# Altium schematic sheet MPU_6050.SchDoc
size A; SheetNumber: 8; SheetTotal: 11
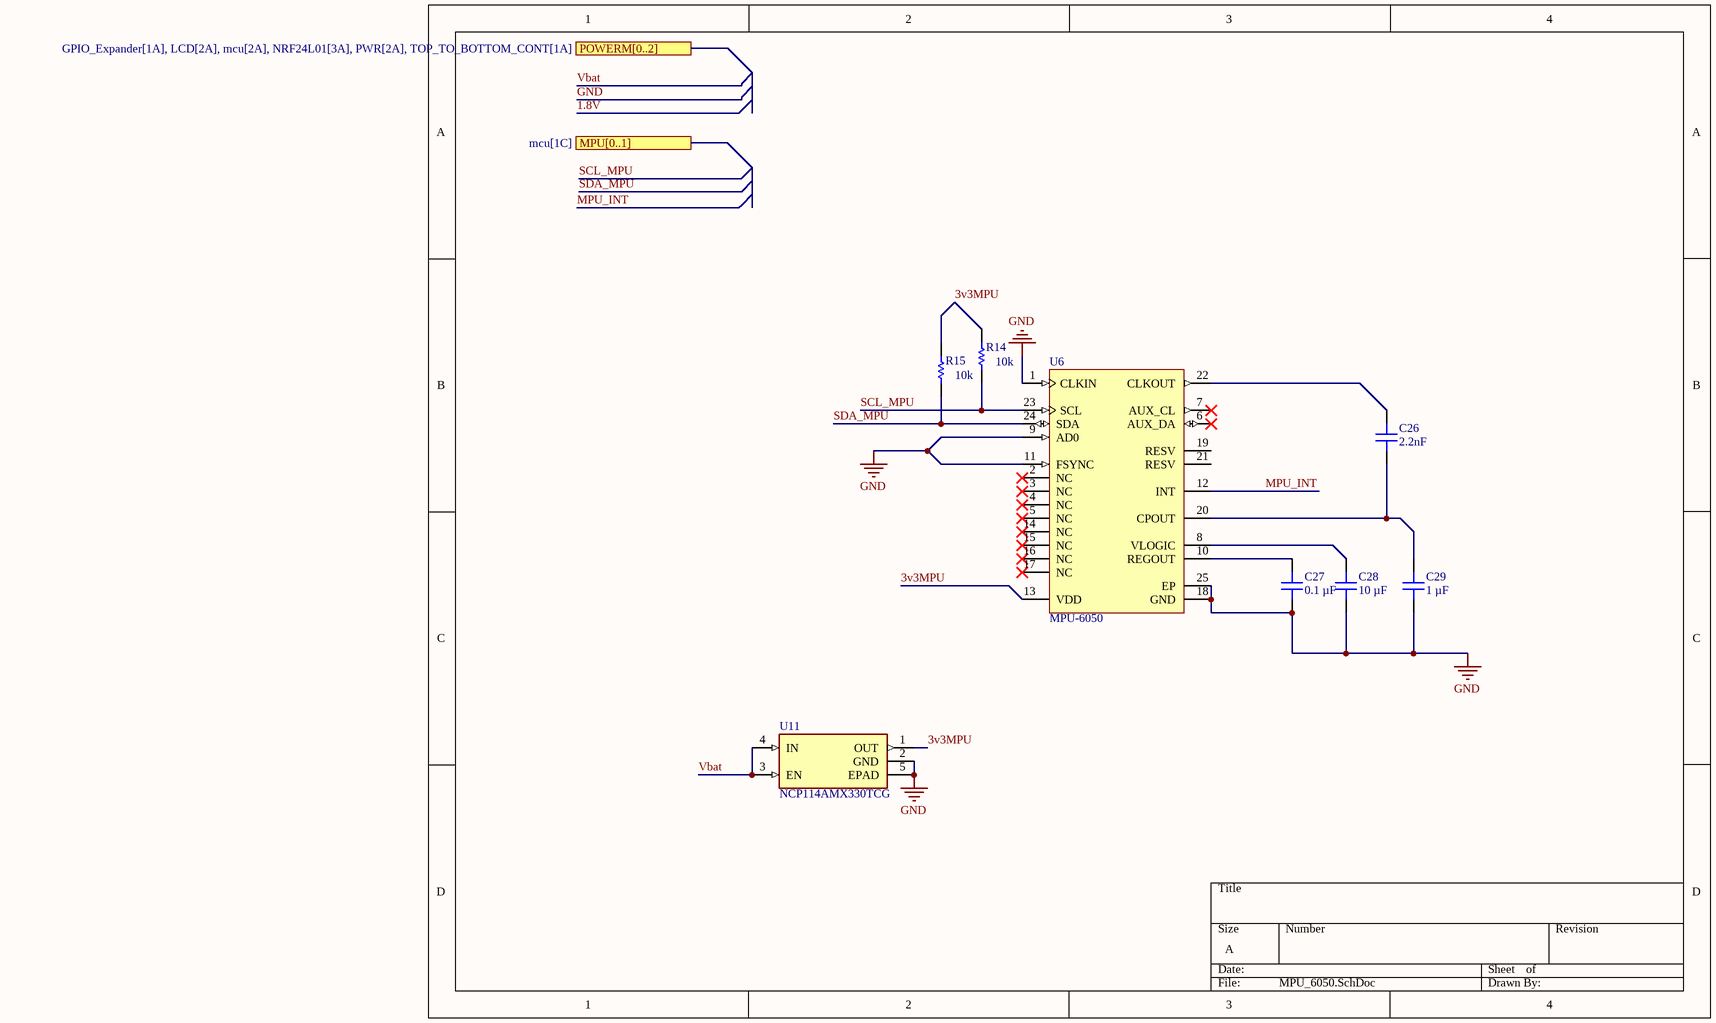
[diagram p0: MPU_6050.SchDoc]

## Parts
C26  Capacitance: 2.2nF  [CAP 0402_1005]
C27  Capacitance: 0.1 µF  [CAP 0402_1005]
C28  Capacitance: 10 µF  [CAP 0402_1005]
C29  Capacitance: 1 µF  [CAP 0402_1005]
R14  resistance: 10k  [RESC1005X40X25LL05T10]  (hidden comment: 0402WGF1002TCE)
R15  resistance: 10k  [RESC1005X40X25LL05T10]  (hidden comment: 0402WGF1002TCE)
U6  MPU-6050  [IS-QFN-24_V]
U11  NCP114AMX330TCG  [REG_NCP114AMX330TCG]

## Ports
MPU[0..1] (see mcu[1C]), POWERM[0..2] (see GPIO_Expander[1A], LCD[2A], mcu[2A], NRF24L01[3A], PWR[2A], TOP_TO_BOTTOM_CONT[1A])

## Nets
GND: C27.1 C28.1 C29.1 U6.1(CLKIN) U6.9(AD0) U6.11(FSYNC) U6.18(GND) U6.25(EP) U11.2(GND) U11.5(EPAD)
3v3MPU: R14.2 R15.2 U6.13(VDD) U11.1(OUT)
MPU_INT: U6.12(INT)
SCL_MPU: R14.1 U6.23(SCL)
SDA_MPU: R15.1 U6.24(SDA)
Vbat: U11.3(EN) U11.4(IN)
NetC26_1: C26.1 C29.2 U6.20(CPOUT)
NetC26_2: C26.2 U6.22(CLKOUT)
NetC27_2: C27.2 U6.10(REGOUT)
NetC28_2: C28.2 U6.8(VLOGIC)

Not connected (* = marked no-connect by the designer): U6 2(NC)* 3(NC)* 4(NC)* 5(NC)* 6(AUX_DA)* 7(AUX_CL)* 14(NC)* 15(NC)* 16(NC)* 17(NC)* 19(RESV) 21(RESV)

## Library data of the parts
C26 C29 = 0402DD105KAT2A: 10V 1uF X5R ±10% 0402 Multilayer Ceramic Capacitors MLCC - SMD/SMT ROHS; Manufacturer: Samsung Electro-Mechanics; MFR.Part #: CL05A105KP5NNNC; JLCPCB Part #: C14445
C27 = 0402B104J160CT: 100nF 16V X7R ±10% 0402 Multilayer Ceramic Capacitors MLCC - SMD/SMT ROHS; Manufacturer: YAGEO; MFR.Part #: CC0402KRX7R7BB104; JLCPCB Part #: C60474
C28 = 0402DD105KAT2A: 10V 1uF X5R ±10% 0402 Multilayer Ceramic Capacitors MLCC - SMD/SMT ROHS; Manufacturer: Samsung Electro-Mechanics; MFR.Part #: CL05A106MQ5NUNC; JLCPCB Part #: C15525
R14 R15 = CMP-2002-03043-1: Manufacturer: UNI-ROYAL(Uniroyal Elec); JLCPCB Part #: C25744; MFR.Part #: 0402WGF1002TCE
U6 = CMP-1753-00002-2: 3-Axis Gyroscope, Accelerometer and a Digital Motion Processor(TM) (DMP), 2.375 to 3.46 V, -40 to 85 degC, 24-Pin QFN, RoHS, Tape and Reel; Manufacturer: TDK InvenSense; MFR.Part #: MPU-6050; JLCPCB Part #: C24112
U11 = NCP114AMX330TCG: Linear Voltage Regulator IC Positive Fixed 1 Output 300mA 4-UDFN (1.0x1.0); Manufacturer: onsemi; MFR.Part #: NCP114AMX330TCG; JLCPCB Part #: C133056